# Altium project JH MCU Board.PrjPcb
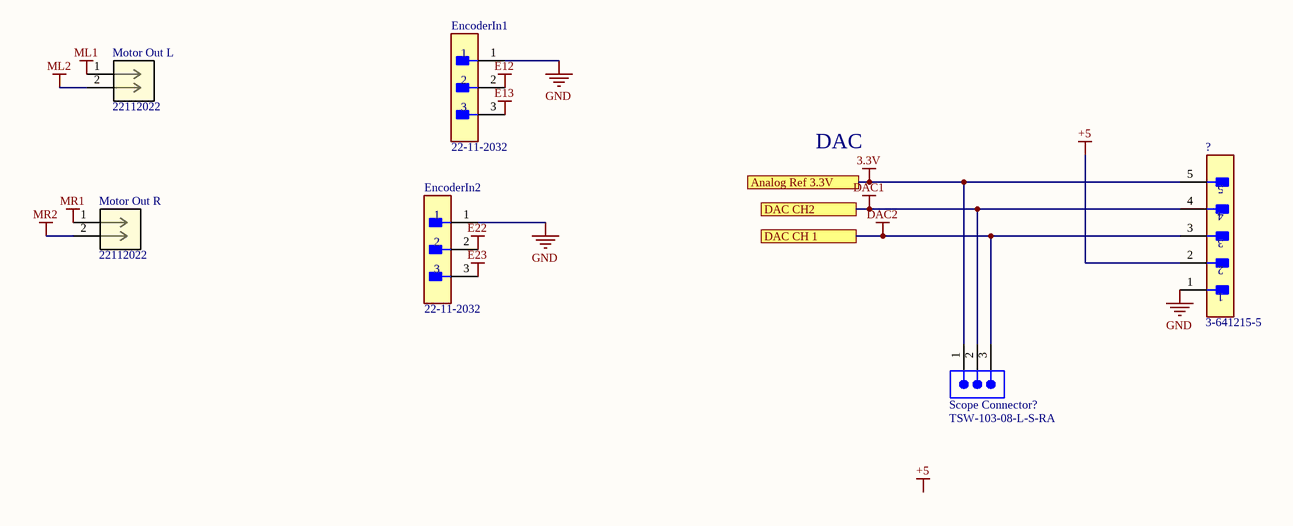
[diagram p0: JH MCU Board 2.SchDoc]
1 sheet, 6 parts. Net scope: flat (ports and power ports of the same name join across sheets).
Board file: JH MCU Board.PcbDoc

## Sheet JH MCU Board 2.SchDoc
size A4; SheetNumber: 2; SheetTotal: 2

### Parts
DAC  3-641215-5  [FP-3-641215-5-MFG]
EncoderIn1  22-11-2032  [FP-22-11-2032-MFG]
EncoderIn2  22-11-2032  [FP-22-11-2032-MFG]
Motor_Out_L  22112022  [CONN_22-11-2022_MOL]
Motor_Out_R  22112022  [CONN_22-11-2022_MOL]
Scope  TSW-103-08-L-S-RA  [SMTC-TSW-103-08-X-S-RA]

### Ports
Analog Ref 3.3V, DAC CH2, DAC CH 1

### Nets
3.3V: DAC.5 Scope.1 ; port Analog Ref 3.3V
+5: DAC.2
DAC1: DAC.4 Scope.2 ; port DAC CH2
DAC2: DAC.3 Scope.3 ; port DAC CH 1
E12: EncoderIn1.2
E13: EncoderIn1.3
E22: EncoderIn2.2
E23: EncoderIn2.3
GND: DAC.1 EncoderIn1.1 EncoderIn2.1
ML1: Motor_Out_L.1
ML2: Motor_Out_L.2
MR1: Motor_Out_R.1
MR2: Motor_Out_R.2

### Notes on the sheet
- DAC
- Labels drawn without touching a wire or pin: +5

### Library data of the parts
DAC = CMP-03369-000062-1: CONN HEADER VERT 5POS 2.54MM; Manufacturer: TE Connectivity; Voltage Rating: 250V; Conn Gender: Male; Conn Orientation: Vertical; Current Rating: 5A; Number Of Contacts: 5
EncoderIn1 EncoderIn2 = CMP-04776-000113-1: CONN HEADER VERT 3POS 2.54MM; Manufacturer: Molex; Number Of Contacts: 3; Voltage Rating: 500V; Conn Gender: Male; Current Rating: 4A; Conn Orientation: Vertical; Device Class L2: Headers and Wire Housings; Number Of Rows: 1; Temperature Range High: +80°C; RoHS: TRUE; ComponentLink2URL: https://www.molex.com/webdocs/datasheets/pdf/en-us/0022112032_PCB_HEADERS.pdf; Manufacturer Part Number: 22-11-2032; Device Class L3: unset; Automotive: No; Temperature: -40°C to +80°C; Temperature Range Low: -40°C; Lead Free: Yes; Pitch: 2.54mm; Footprint Url: https://www.molex.com/pdm_docs/sd/022112032_sd.pdf; Digikey Description: CONN HEADER VERT 3POS 2.54MM; Contact Material: Gold,Nickel; Octopart: https://octopart.com/22-11-2032-molex-10085; Height: 10.91mm; Mouser Description: KK® 254 Solid Header, Vertical, with Friction Lock, 3 Circuits, Gold (Au) Plating; Package: 22-11-2032; Device Class L1: Connectors; Mounting Type: Through Hole; ComponentLink2Description: Datasheet; Category: Conn
Motor_Out_L Motor_Out_R = 22112022: No Description Available; Mfr_Name: Molex Connector Corporation; Copyright: Copyright (C) 2023 Ultra Librarian. All rights reserved.; Manufacturer_Part_Number: 22112022; RefDes: RefDes; Type: DEV
Scope = CMP-1024-00343-1: 0.025" SQ Post Header, Through-hole, Right Angle, -55 to 125 degC, 2.54 mm Pitch, 3-Pin, Male, RoHS; Manufacturer: Samtec; Pitch: 2.54 mm; ComponentLink2Description: Datasheet; Temperature Range: -55 to 125 degC; ComponentLink1Description: Manufacturer URL; Mounting Technology: Through-hole; ComponentLink3URL: http://www.samtec.com/documents/webfiles/cpdf/TSW-XXX-XX-XXX-X-XX-XXX-MKT.pdf; DatasheetVersion: F-214; PackageDescription: .025[0.64] SQ. Post Terminal Strip Assembly; PackageVersion: DM, 8/1988; Orientation: Right Angle; PackageReference: TSW-103-08-X-S-RA; ComponentLink1URL: http://www.samtec.com; ComponentLink3Description: Package Specification; PartNumber: TSW-103-08-L-S-RA; RoHS: True; ComponentLink2URL: http://www.samtec.com/documents/webfiles/pdf/TSW_TH.PDF